# EAGLE design CompletePCBV5 (EAGLE 9.2.1)
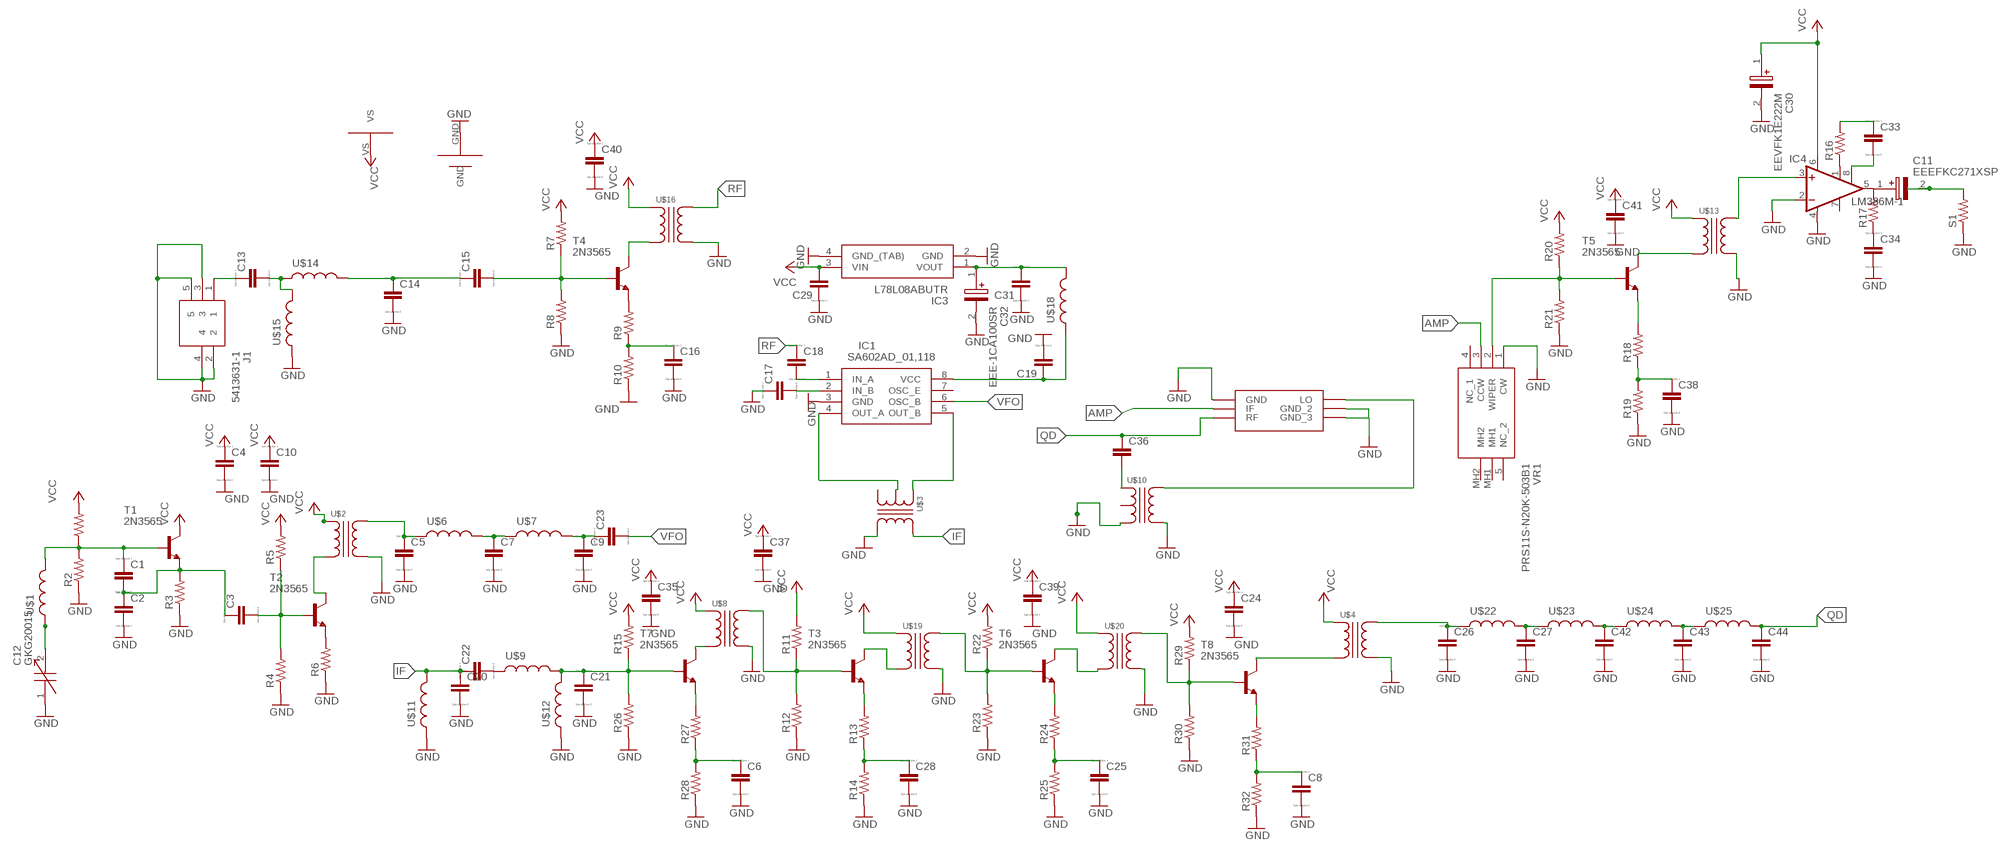
[diagram p0: schematic, sheet 1]

## Parts
C1  C  [C0805]
C2  C  [C0805]
C3  C  [C0805]
C4  C  [C0805]
C5  C  [C0805]
C6  C  [C0805]
C7  C  [C0805]
C8  C  [C0805]
C9  C  [C0805]
C10  C  [C0805]
C11  EEEFKC271XSP  [FKSV(D8)]
C12  GKG20015  [GKG20015]
C13  C  [C0805]
C14  C  [C0805]
C15  C  [C0805]
C16  C  [C0805]
C17  C  [C0805]
C18  C  [C0805]
C19  C  [C0805]
C20  C  [C0805]
C21  C  [C0805]
C22  C  [C0805]
C23  C  [C0805]
C24  C  [C0805]
C25  C  [C0805]
C26  C  [C0805]
C27  C  [C0805]
C28  C  [C0805]
C29  C  [C0805]
C30  EEVFK1E222M  [FKV(J16)]
C31  C  [C0805]
C32  EEE-1CA100SR  [SV(B)]
C33  C  [C0805]
C34  CC1206  [C1206]
C35  C  [C0805]
C36  C-EUC0805  [C0805]
C37  C  [C0805]
C38  C  [C0805]
C39  C  [C0805]
C40  C  [C0805]
C41  C  [C0805]
C42  C  [C0805]
C43  C  [C0805]
C44  C  [C0805]
IC1  SA602AD_01,118  [SOIC127P600X175-8N]
IC3  L78L08ABUTR  [ST-SOT-89]
IC4  LM386M-1  [SO08]
J1  5413631-1  [54136311]
R1  R-US_R0805  [R0805]
R2  R-US_R0805  [R0805]
R3  R-US_R0805  [R0805]
R4  R-US_R0805  [R0805]
R5  R-US_R0805  [R0805]
R6  R-US_R0805  [R0805]
R7  R-US_R0805  [R0805]
R8  R-US_R0805  [R0805]
R9  R-US_R0805  [R0805]
R10  R-US_R0805  [R0805]
R11  R-US_R0805  [R0805]
R12  R-US_R0805  [R0805]
R13  R-US_R0805  [R0805]
R14  R-US_R0805  [R0805]
R15  R-US_R0805  [R0805]
R16  R-US_R0805  [R0805]
R17  R-US_R0805  [R0805]
R18  R-US_R0805  [R0805]
R19  R-US_R0805  [R0805]
R20  R-US_R0805  [R0805]
R21  R-US_R0805  [R0805]
R22  R-US_R0805  [R0805]
R23  R-US_R0805  [R0805]
R24  R-US_R0805  [R0805]
R25  R-US_R0805  [R0805]
R26  R-US_R0805  [R0805]
R27  R-US_R0805  [R0805]
R28  R-US_R0805  [R0805]
R29  R-US_R0805  [R0805]
R30  R-US_R0805  [R0805]
R31  R-US_R0805  [R0805]
R32  R-US_R0805  [R0805]
S1  R-US_0207/5V  [0207/5V]
T1  2N3565  [TO92]
T2  2N3565  [TO92]
T3  2N3565  [TO92]
T4  2N3565  [TO92]
T5  2N3565  [TO92]
T6  2N3565  [TO92]
T7  2N3565  [TO92]
T8  2N3565  [TO92]
U$1  WOUNDINDUCTOR  [WOUNDINDUCTOR]
U$2  RFTRANSFORMER  [RFTRABSFORMER]
U$3  42IF123  [42IF123]
U$4  RFTRANSFORMER  [RFTRABSFORMER]
U$5  ALLIGATORCLIPS  [ALLIGATORCONNECTOR]
U$6  WOUNDINDUCTOR  [WOUNDINDUCTOR]
U$7  WOUNDINDUCTOR  [WOUNDINDUCTOR]
U$8  RFTRANSFORMER  [RFTRABSFORMER]
U$9  WOUNDINDUCTOR  [WOUNDINDUCTOR]
U$10  42IF123  [42IF123]
U$11  WOUNDINDUCTOR  [WOUNDINDUCTOR]
U$12  WOUNDINDUCTOR  [WOUNDINDUCTOR]
U$13  RFTRANSFORMER  [RFTRABSFORMER]
U$14  WOUNDINDUCTOR  [WOUNDINDUCTOR]
U$15  WOUNDINDUCTOR  [WOUNDINDUCTOR]
U$16  RFTRANSFORMER  [RFTRABSFORMER]
U$17  ADE-1  [ADE-1]
U$18  WOUNDINDUCTOR  [WOUNDINDUCTOR]
U$19  RFTRANSFORMER  [RFTRABSFORMER]
U$20  RFTRANSFORMER  [RFTRABSFORMER]
U$22  WOUNDINDUCTOR  [WOUNDINDUCTOR]
U$23  WOUNDINDUCTOR  [WOUNDINDUCTOR]
U$24  WOUNDINDUCTOR  [WOUNDINDUCTOR]
U$25  WOUNDINDUCTOR  [WOUNDINDUCTOR]
VR1  PRS11S-N20K-503B1  [PRS11SN20K503B1]

## Nets
AMP: U$17.IF VR1.3(CCW)
GND: C2.2 C4.2 C5.2 C6.2 C7.2 C8.2 C9.2 C10.2 C12.1 C14.2 C16.2 C17.1 C19.2 C20.2 C21.2 C24.2 C25.2 C26.2 C27.2 C28.2 C29.1 C30.2(-) C31.1 C32.2(-) C34.2 C35.2 C37.2 C38.2 C39.2 C40.2 C41.2 C42.2 C43.2 C44.2 IC1.3(GND) IC3.2(GND) IC3.4(GND_(TAB)) IC4.2(-IN) IC4.4(GND) J1.2 J1.3 J1.4 J1.5 R2.1 R3.1 R4.1 R6.1 R8.1 R10.1 R12.1 R14.1 R19.1 R21.1 R23.1 R25.1 R26.1 R28.1 R30.1 R32.1 S1.1 U$2.P$4 U$3.P$4 U$4.P$4 U$5.GND U$8.P$4 U$10.P$3 U$10.P$4 U$11.1 U$12.1 U$13.P$4 U$15.1 U$16.P$4 U$17.GND U$17.GND2(GND_2) U$17.GND3(GND_3) U$19.P$4 U$20.P$4 VR1.1(CW)
IF: C20.1 C22.1 U$3.P$5 U$11.2
N$1: R6.2 T2.3(E)
N$2: T7.1(C) U$8.P$1
N$3: C1.2 C2.1 C3.1 R3.2 T1.3(E)
N$4: C1.1 R1.1 R2.2 T1.2(B) U$1.2
N$5: C3.2 R4.2 R5.1 T2.2(B)
N$6: R22.1 R23.2 T6.2(B) U$19.P$3
N$7: C22.2 U$9.1
N$8: C5.1 U$2.P$3 U$6.1
N$9: R9.2 T4.3(E)
N$10: C7.1 U$6.2 U$7.1
N$11: T2.1(C) U$2.P$1
N$12: C12.2 U$1.1
N$13: C9.1 C23.1 U$7.2
N$14: C16.1 R9.1 R10.2
N$15: C13.1 J1.1
N$16: C14.1 C15.1 U$14.2
N$18: C15.2 R7.1 R8.2 T4.2(B)
N$19: T4.1(C) U$16.P$1
N$20: IC1.5(OUT_B) U$3.P$2
N$21: IC1.4(OUT_A) U$3.P$1
N$22: C28.1 R13.1 R14.2
N$23: C17.2 IC1.2(IN_B)
N$24: C18.2 IC1.1(IN_A)
N$25: C36.2 U$10.P$2
N$26: R29.1 R30.2 T8.2(B) U$20.P$3
N$27: U$10.P$5 U$17.LO
N$28: R20.1 R21.2 T5.2(B) VR1.2(WIPER)
N$29: R18.2 T5.3(E)
N$30: C38.1 R18.1 R19.2
N$31: R11.1 R12.2 T3.2(B) U$8.P$3
N$32: T5.1(C) U$13.P$1
N$33: T3.1(C) U$19.P$1
N$34: C19.1 IC1.8(VCC) U$18.1
N$35: IC4.3(+IN) U$13.P$3
N$36: C13.2 U$14.1 U$15.2
N$37: R24.2 T6.3(E)
N$38: C25.1 R24.1 R25.2
N$39: R13.2 T3.3(E)
N$40: IC4.1(GAIN) R16.1
N$41: C11.1(+) IC4.5(OUT) R17.2
N$42: C34.1 R17.1
N$43: C21.1 R15.1 R26.2 T7.2(B) U$9.2 U$12.2
N$44: C33.1 R16.2
N$45: C33.2 IC4.8(GAIN)
N$46: C11.2(-) S1.2
N$47: C31.2 C32.1(+) IC3.1(VOUT) U$18.2
N$48: R31.2 T8.3(E)
N$49: C6.1 R27.1 R28.2
N$50: R27.2 T7.3(E)
N$51: C8.1 R31.1 R32.2
N$52: T6.1(C) U$20.P$1
N$53: C26.1 U$4.P$3 U$22.1
N$54: T8.1(C) U$4.P$1
N$55: C27.1 U$22.2 U$23.1
N$56: C42.1 U$23.2 U$24.1
N$57: C43.1 U$24.2 U$25.1
QD: C36.1 C44.1 U$17.RF U$25.2
RF: C18.1 U$16.P$3
VCC: C4.1 C10.1 C24.1 C29.2 C30.1(+) C35.1 C37.1 C39.1 C40.1 C41.1 IC3.3(VIN) IC4.6(VS) R1.2 R5.2 R7.2 R11.2 R15.2 R20.2 R22.2 R29.2 T1.1(C) U$2.P$2 U$4.P$2 U$5.VS U$8.P$2 U$13.P$2 U$16.P$2 U$19.P$2 U$20.P$2
VFO: C23.2 IC1.6(OSC_B)
Unconnected: IC1.7(OSC_E) IC4.7(BYPASS) U$3.P$3 U$10.P$1 VR1.4(NC_1) VR1.5(NC_2) VR1.MH1 VR1.MH2

## Library data of the parts
C1-C10 C13-C29 C31 C33-C35 C37-C44 = eagle-ltspice:C: CAPACITOR, European symbol; SPICEMODEL: NONE; SPICEPREFIX: C
C11 = SamacSys_Parts:EEEFKC271XSP: Panasonic 270uF 16 V dc Aluminium Electrolytic Capacitor, FKS Series 2000h 6.3 (Dia.) x 7.7mm Source: Datasheet <https://industrial.panasonic.com/cdbs/www-data/pdf/RDE0000/ABA0000C569.pdf>; DESCRIPTION: Panasonic 270uF 16 V dc Aluminium Electrolytic Capacitor, FKS Series 2000h 6.3 (Dia.) x 7.7mm; HEIGHT: mm; MANUFACTURER_NAME: Panasonic; MANUFACTURER_PART_NUMBER: EEEFKC271XSP
C12 = SamacSys_Parts:GKG20015: Trimmer / Variable Capacitors 5-20pF 100V 85 DEG Source: Datasheet <http://www.mouser.com/datasheet/2/384/659305J-1204018.pdf>; DESCRIPTION: Trimmer / Variable Capacitors 5-20pF 100V 85 DEG; HEIGHT: 5.1mm; MANUFACTURER_NAME: Sprague Goodman; MANUFACTURER_PART_NUMBER: GKG20015; MOUSER_PART_NUMBER: 659-GKG20015; MOUSER_PRICE-STOCK: https://www.mouser.com/Search/Refine.aspx?Keyword=659-GKG20015
C30 = SamacSys_Parts:EEVFK1E222M: Ecap 2200uF 25V J16 Case FK SMD Panasonic Aluminium Electrolytic Capacitor 2200uF 25 V dc 16mm Surface Mount series FK SMD lifetime 5000h Source: Datasheet <https://industrial.panasonic.com/cdbs/www-data/pdf/RDE0000/ABA0000C1181.pdf>; DESCRIPTION: Ecap 2200uF 25V J16 Case FK SMD Panasonic Aluminium Electrolytic Capacitor 2200uF 25 V dc 16mm Surface Mount series FK SMD lifetime 5000h; HEIGHT: mm; MANUFACTURER_NAME: Panasonic; MANUFACTURER_PART_NUMBER: EEVFK1E222M
C32 = SamacSys_Parts:EEE-1CA100SR: Aluminum Electrolytic Capacitors - SMD 10uF 16V Source: Datasheet <https://componentsearchengine.com/Datasheets/1/EEE-1CA100SR.pdf>; DESCRIPTION: Aluminum Electrolytic Capacitors - SMD 10uF 16V; HEIGHT: mm; MANUFACTURER_NAME: Panasonic; MANUFACTURER_PART_NUMBER: EEE-1CA100SR; MOUSER_PART_NUMBER: 667-EEE-1CA100SR; MOUSER_PRICE-STOCK: https://www.mouser.com/Search/Refine.aspx?Keyword=667-EEE-1CA100SR
C36 = rcl:C-EU: CAPACITOR, European symbol; SPICEPREFIX: C
IC1 = SamacSys_Parts:SA602AD_01,118: NXP - SA602AD/01,118 - DOUBLE-BALANCED MIXER, 500MHZ, SOIC-8 Source: Datasheet <https://www.mouser.com/datasheet/2/302/SA602A-1127653.pdf>; DESCRIPTION: NXP - SA602AD/01,118 - DOUBLE-BALANCED MIXER, 500MHZ, SOIC-8; HEIGHT: 1.75mm; MANUFACTURER_NAME: NXP; MANUFACTURER_PART_NUMBER: SA602AD/01,118; MOUSER_PART_NUMBER: 771-SA602AD/01-T
IC3 = SamacSys_Parts:L78L08ABUTR: L78L08ABUTR, Voltage Regulator, 0.1A 8 V, 4-Pin SOT-89 Source: Datasheet <https://componentsearchengine.com/Datasheets/1/L78L08ABUTR.pdf>; DESCRIPTION: L78L08ABUTR, Voltage Regulator, 0.1A 8 V, 4-Pin SOT-89; HEIGHT: mm; MANUFACTURER_NAME: STMicroelectronics; MANUFACTURER_PART_NUMBER: L78L08ABUTR; MOUSER_PART_NUMBER: 511-L78L08ABU; MOUSER_PRICE-STOCK: https://www.mouser.com/Search/Refine.aspx?Keyword=511-L78L08ABU
IC4 = linear:LM386?-*: Low Voltage Audio Power Amplifier Source: http://cache.national.com/ds/LM/LM386.pdf
J1 = SamacSys_Parts:5413631-1: TE Connectivity Right Angle 50 Through Hole BNC Connector, jack, Nickel, Solder Termination Source: Datasheet <https://componentsearchengine.com/Datasheets/1/5413631-1.pdf>; DESCRIPTION: TE Connectivity Right Angle 50 Through Hole BNC Connector, jack, Nickel, Solder Termination; HEIGHT: 11.15mm; MANUFACTURER_NAME: TE Connectivity; MANUFACTURER_PART_NUMBER: 5413631-1; MOUSER_PART_NUMBER: 571-5413631-1; MOUSER_PRICE-STOCK: https://www.mouser.com/Search/Refine.aspx?Keyword=571-5413631-1
R1-R32 = resistor:R-US_: RESISTOR, American symbol
S1 = rcl:R-US_: RESISTOR, American symbol; SPICEPREFIX: R
T1-T8 = transistor:2N3565: NPN TRANSISTOR
U$1 U$6 U$7 U$9 U$11 U$12 U$14 U$15 U$18 U$22-U$25 = Custom:WOUNDINDUCTOR
U$2 U$4 U$8 U$13 U$16 U$19 U$20 = Custom:RFTRANSFORMER
U$3 U$10 = Custom:42IF123
U$5 = Custom:ALLIGATORCLIPS
U$17 = Custom:ADE-1
VR1 = SamacSys_Parts:PRS11S-N20K-503B1: Res Carbon Film POT 50K Ohm 20% 0.05W(1/20W) 1(Elec)/1(Mech)Turn 6mm (11.7 X 18.5 X 21.4mm) Gull Wing SMD Tube Source: Datasheet <https://componentsearchengine.com/Datasheets/1/PRS11S-N20K-503B1.pdf>; DESCRIPTION: Res Carbon Film POT 50K Ohm 20% 0.05W(1/20W) 1(Elec)/1(Mech)Turn 6mm (11.7 X 18.5 X 21.4mm) Gull Wing SMD Tube; HEIGHT: 20mm; MANUFACTURER_NAME: Bourns; MANUFACTURER_PART_NUMBER: PRS11S-N20K-503B1; MOUSER_PART_NUMBER: 652-PRS11SN20K503B1; MOUSER_PRICE-STOCK: https://www.mouser.com/Search/Refine.aspx?Keyword=652-PRS11SN20K503B1

## Net classes
0 default: width 0.762 mm
1 POWER: width 0.381 mm
2 RF: width 0.635 mm
3 VCC: width 0.889 mm

## Board
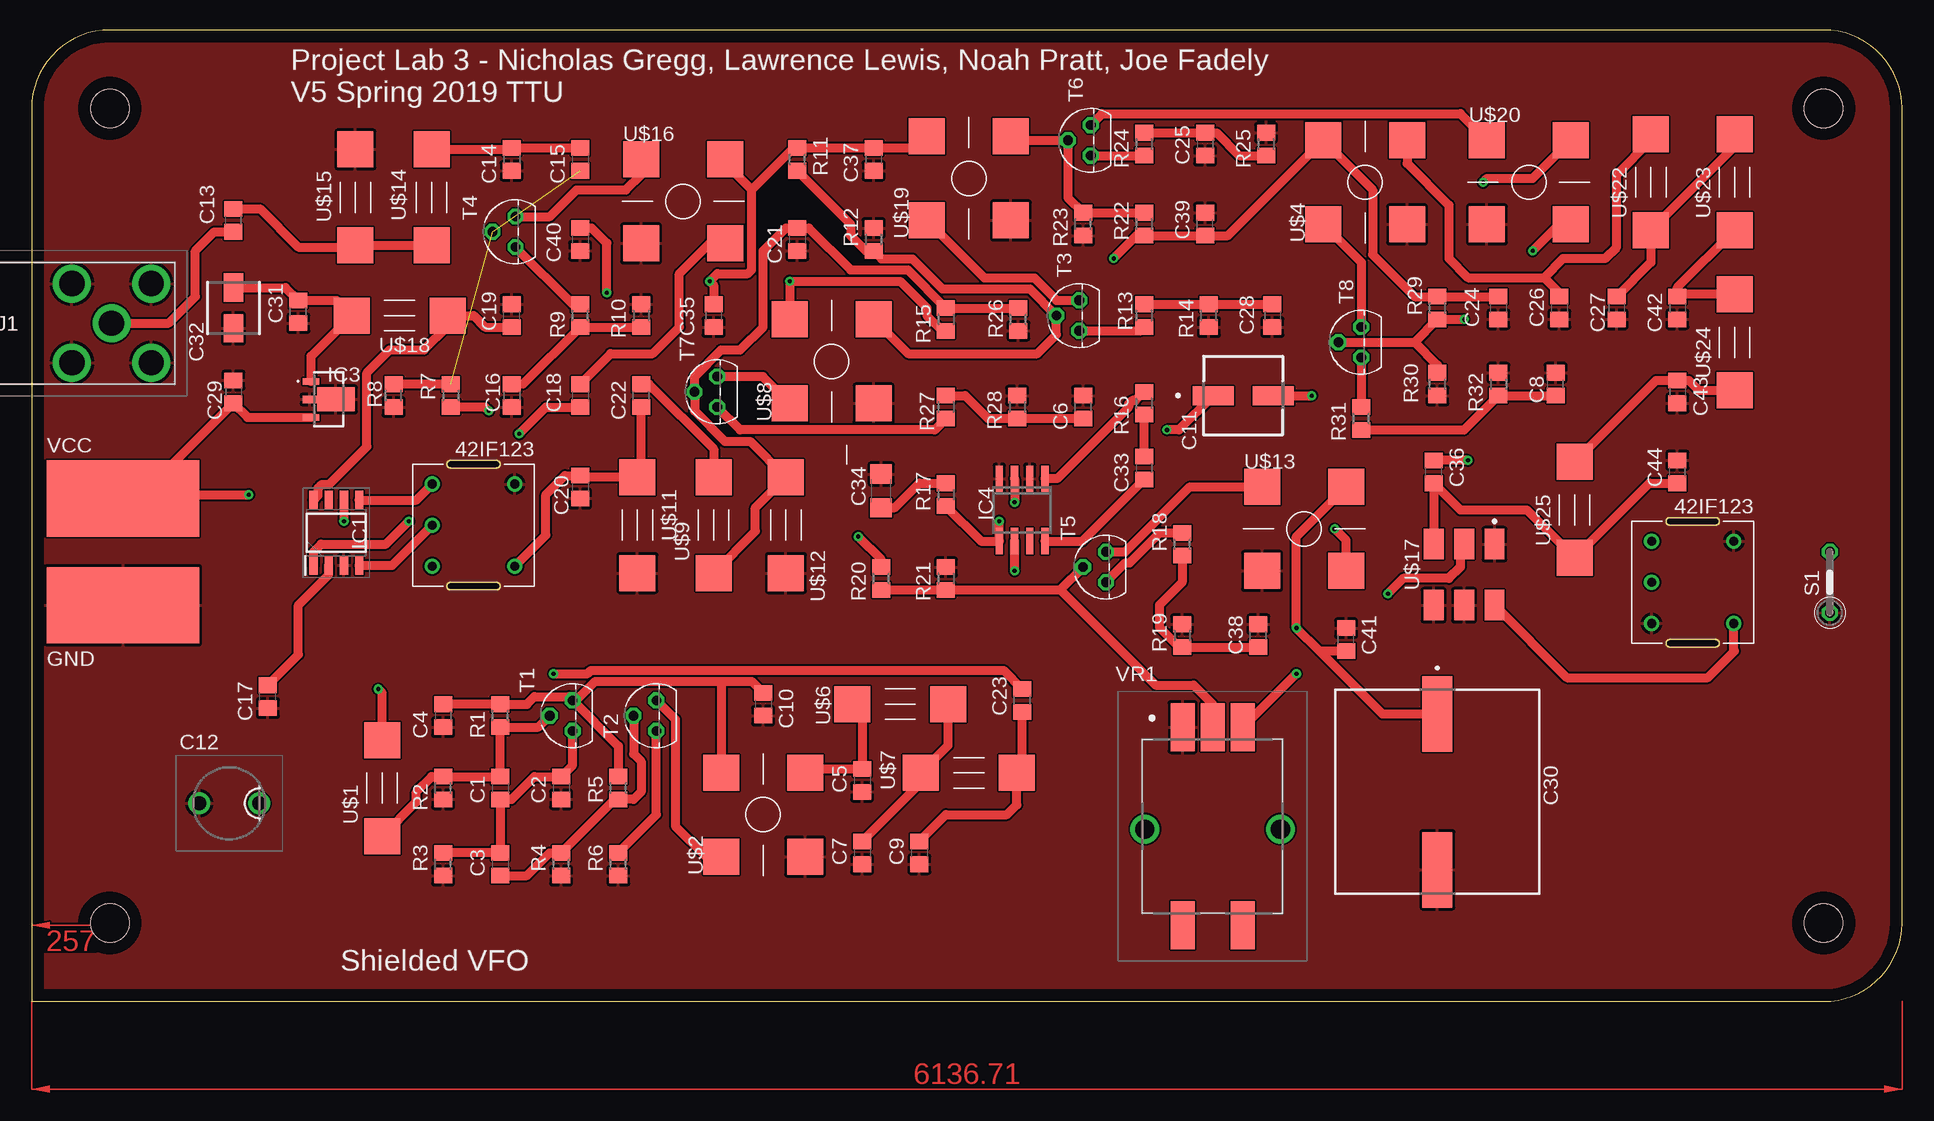
[diagram p1: board, top side]
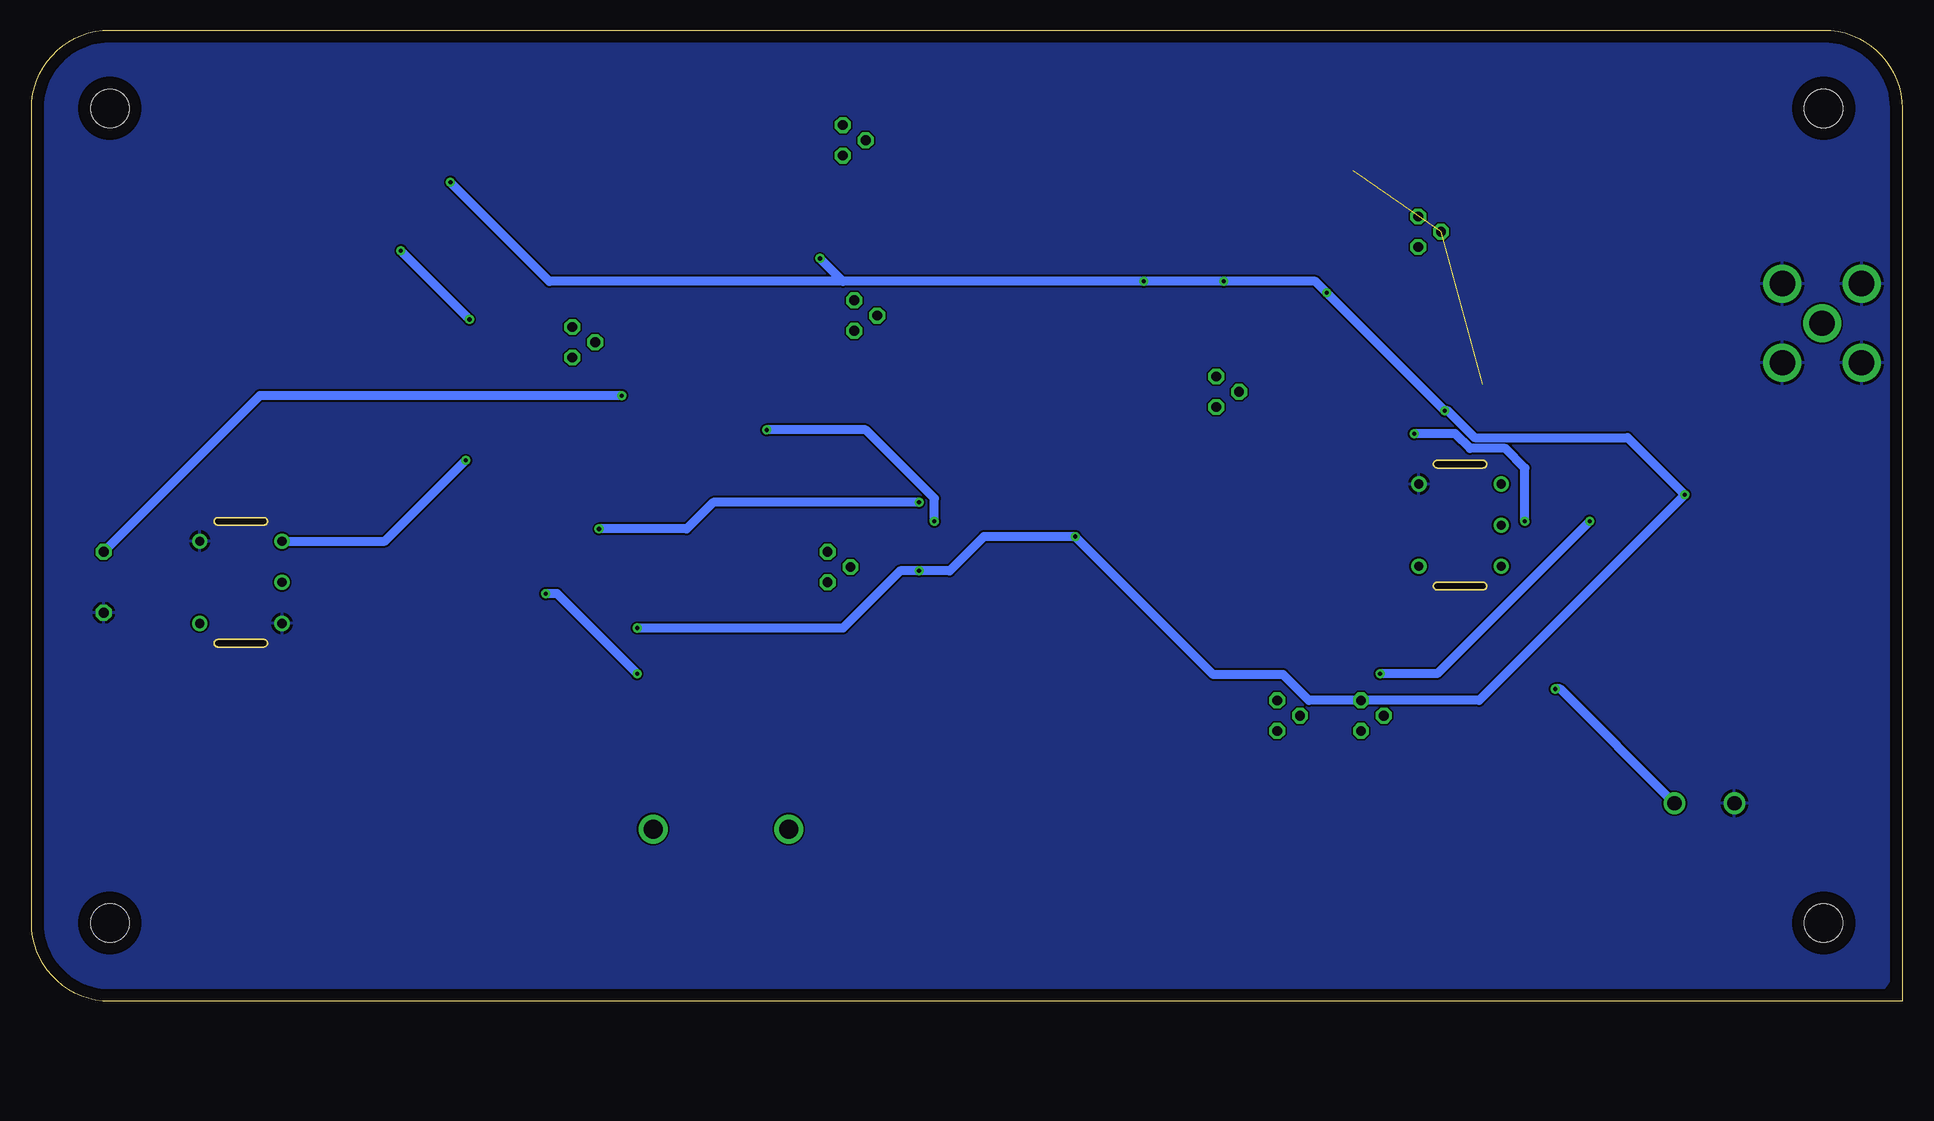
[diagram p2: board, bottom side, seen from below]

Size 155.87 x 80.95 mm. Coordinates in mm from the lower left corner, seen from the top.
Outline: 0,74.42 0,0 149.34,0 arc90 155.87,6.53 155.87,74.42 arc90 149.34,80.95 6.53,80.95 arc90 0,74.42
Copper layers (1*16): Top 0.035mm / dielectric 1.5mm / Bottom 0.035mm
Design rules "default": minimum track width 6mil, minimum drill 0.35mm, track to track 6mil, track to pad 6mil, pad to pad 6mil, via to via 6mil, smd to smd 6mil, copper to edge 40mil, drill to drill 6mil, minimum pad ring 10mil, minimum via ring 8mil, stop-mask expansion 4mil, vias tented up to drill 0mil, thermal gap 10mil
Holes 3.2 mm at 6.53,74.42 149.34,74.42 149.34,6.53 6.53,6.53

### Footprints (pad centres in the part's own frame; a part is rotated, then mirrored left to right if it is on the bottom)
C0805 = smd 1.3 x 1.5: 1 -0.95,0; 2 0.95,0
FKSV(D8) = smd 3.4 x 1.6: 1 -2.5,0; 2 2.5,0
GKG20015 = drill 1.2 pad 1.8: 1 0,0; 2 5,0
FKV(J16) = smd 6.3 x 2.5: 1 -6.5,0; 2 6.5,0
SV(B) = smd 2.35 x 1.6: 1 -1.7,0; 2 1.7,0
C1206 = smd 1.6 x 1.8: 1 -1.4,0; 2 1.4,0
SOIC127P600X175-8N = smd 1.55 x 0.7: 1 -2.725,1.905; 2 -2.725,0.635; 3 -2.725,-0.635; 4 -2.725,-1.905; 5 2.725,-1.905; 6 2.725,-0.635; 7 2.725,0.635; 8 2.725,1.905
ST-SOT-89 = smd 0.57 x 1.4: 1 -1.5,-1.475; 3 1.5,-1.475 | smd 0.65 x 1.2: 2 0,-1.575 | smd 2 x 3.15: 4 0,0.6
SO08 = smd 0.6 x 2.2: 1 -1.905,-2.6; 2 -0.635,-2.6; 3 0.635,-2.6; 4 1.905,-2.6; 5 1.905,2.6; 6 0.635,2.6; 7 -0.635,2.6; 8 -1.905,2.6
54136311 = drill 2.11 pad 3.165: 1 0,0; 2 -3.3,3.3; 3 -3.3,-3.3; 4 3.3,-3.3; 5 3.3,3.3
R0805 = smd 1.3 x 1.5: 1 -0.95,0; 2 0.95,0
0207/5V = drill 0.813 octagon: 1 -2.54,0; 2 2.54,0
TO92 = drill 0.813 octagon: 1 1.27,0; 2 0,1.905; 3 -1.27,0
WOUNDINDUCTOR = smd 3 x 3: 1 0,4; 2 0,-4
RFTRABSFORMER = smd 3 x 3: P$1 -3.5,3.5; P$2 3.5,3.5; P$3 3.5,-3.5; P$4 -3.5,-3.5
42IF123 = drill 0.762: P$1 -3.429,0; P$2 -3.429,3.429; P$3 -3.429,-3.429; P$4 3.429,3.429; P$5 3.429,-3.429
ALLIGATORCONNECTOR = smd 6.35 x 12.7: GND 7.62,2.54; VS -1.27,2.54
ADE-1 = smd 1.65 x 2.54: GND -2.54,-2.54; GND2 0,2.54; GND3 2.54,2.54; IF 0,-2.54; LO -2.54,2.54; RF 2.54,-2.54
PRS11SN20K503B1 = smd 2 x 4: 1 2.5,-8.25; 2 0,-8.25; 3 -2.5,-8.25; 4 -2.5,8.25; 5 2.5,8.25 | drill 1.6 pad 2.4: MH1 -5.65,0.25; MH2 5.65,0.25

### Placement (x,y rotation side)
C1  39.05,17.78 270 top
C2  44.13,17.78 270 top
C3  39.05,11.43 270 top
C4  34.29,23.81 270 top
C5  69.22,18.41 270 top
C6  87.63,49.53 90 top
C7  69.22,12.38 270 top
C8  127,51.44 90 top
C9  73.98,12.38 270 top
C10  60.96,24.77 270 top
C11  100.97,50.48 0 top
C12  13.97,16.51 0 top
C13  16.83,65.09 90 top
C14  40.01,70.17 270 top
C15  45.72,70.17 270 top
C16  40.01,50.48 270 top
C17  19.68,25.4 90 top
C18  45.72,50.48 270 top
C19  40.01,57.15 90 top
C20  45.72,42.86 270 top
C21  63.82,63.5 270 top
C22  50.8,50.48 90 top
C23  82.55,25.08 90 top
C24  122.24,57.78 270 top
C25  97.79,71.44 270 top
C26  127.32,57.78 270 top
C27  132.08,57.78 270 top
C28  103.41,57.15 270 top
C29  16.83,50.8 270 top
C30  117.16,17.46 270 top
C31  22.23,57.47 90 top
C32  16.83,57.78 270 top
C33  92.71,44.45 270 top
C34  70.8,42.55 90 top
C35  56.83,57.15 270 top
C36  116.84,44.13 90 top
C37  70.17,70.17 270 top
C38  102.23,30.48 90 top
C39  97.79,64.77 90 top
C40  45.72,63.5 270 top
C41  109.54,30.16 90 top
C42  137.16,57.78 270 top
C43  137.16,50.8 270 top
C44  137.16,44.13 90 top
IC1  25.4,39.05 90 top
IC3  24.77,50.16 270 top
IC4  82.55,40.96 180 top
J1  6.67,56.52 0 top
R1  39.05,23.81 90 top
R2  34.29,17.78 90 top
R3  34.29,11.43 90 top
R4  44.13,11.43 90 top
R5  48.9,17.78 90 top
R6  48.9,11.43 90 top
R7  34.92,50.48 270 top
R8  30.16,50.48 90 top
R9  45.72,57.15 90 top
R10  50.8,57.15 270 top
R11  63.82,70.17 90 top
R12  70.17,63.5 270 top
R13  92.71,57.15 270 top
R14  98.11,57.15 90 top
R15  76.2,56.83 270 top
R16  92.71,49.85 270 top
R17  76.2,42.23 270 top
R18  95.89,38.1 90 top
R19  95.89,30.48 270 top
R20  70.8,35.24 90 top
R21  76.2,35.24 270 top
R22  92.71,64.77 270 top
R23  87.63,64.77 90 top
R24  92.71,71.44 270 top
R25  102.87,71.44 270 top
R26  82.23,56.83 90 top
R27  76.2,49.53 270 top
R28  82.14,49.53 270 top
R29  117.16,57.78 90 top
R30  117.16,51.44 90 top
R31  110.81,48.58 90 top
R32  122.24,51.44 270 top
S1  149.86,34.92 90 top
T1  45.09,23.81 90 top
T2  52.07,23.81 90 top
T3  87.31,57.15 90 top
T4  40.32,64.14 90 top
T5  89.53,36.2 90 top
T6  88.27,71.75 90 top
T7  57.15,50.8 90 top
T8  110.81,54.93 90 top
U$1  29.21,17.78 0 top
U$2  60.96,15.56 90 top
U$3  36.83,39.69 0 top
U$4  111.12,68.26 90 top
U$5  5.08,40.64 270 top
U$6  72.39,24.77 90 top
U$7  78.11,19.05 90 top
U$8  66.67,53.34 90 top
U$9  56.83,39.69 0 top
U$10  138.43,34.92 0 top
U$11  50.48,39.69 180 top
U$12  62.87,39.69 180 top
U$13  106.05,39.37 0 top
U$14  33.34,66.99 180 top
U$15  26.99,66.99 0 top
U$16  54.29,66.67 0 top
U$17  119.38,35.56 180 top
U$18  30.67,57.15 270 top
U$19  78.11,68.58 90 top
U$20  124.78,68.26 0 top
U$22  134.94,68.26 0 top
U$23  141.92,68.26 0 top
U$24  141.92,54.93 0 top
U$25  128.59,40.96 0 top
VR1  98.42,14.61 180 top

### Tracks (layer width: path | path; a pad name or v marks a point on that pad's centre or on a via)
AMP  (via drill 0.35)
  Top 0.762: VR1.3 105.38,27.3 v105.41,27.3 | U$17.IF 119.06,37.78 119.06,36.2 118.11,35.24 114.3,35.24 v113.03,33.97
  Bottom 0.762: v105.41,27.3 112.08,33.97 v113.03,33.97
GND
  pour Top: 0,80.01 158.12,80.01 158.12,-1.27 0,-1.27
  pour Bottom: 0,80.01 158.43,80.01 158.43,-1.27 6.53,-1.27 arc-90 0,5.26
HOLE
  cutout Top: 136.53,40.32 140.34,40.32 arc-90 140.65,40.01 arc-90 140.34,39.69 136.53,39.69 arc-180
HOLE1
  cutout Top: 136.53,30.16 140.34,30.16 arc-90 140.65,29.84 arc-90 140.34,29.53 136.53,29.53 arc-180
HOLE2
  cutout Top: 34.92,45.09 38.73,45.09 arc-90 39.05,44.77 arc-90 38.73,44.45 34.92,44.45 arc-180
HOLE3
  cutout Top: 34.92,34.92 38.73,34.92 arc-90 39.05,34.61 arc-90 38.73,34.29 34.92,34.29 arc-180
IF
  Top 0.762: U$3.P$5 42.86,38.86 42.86,42.23 44.45,43.81 C20.1 45.84,43.69 U$11.2 50.8,44.01 C22.1
N$1
  Top 0.762: R6.2 52.07,15.55 T2.3
N$2
  Top 0.762: U$8.P$1 60.95,52.07 T7.1
N$3
  Top 0.762: T1.3 45.09,19.68 C2.1 41.91,18.73 40.01,16.83 C1.2 C3.1 R3.2
N$4
  Top 0.762: U$1.2 32.07,16.64 32.07,17.46 33.34,18.73 R2.2 C1.1 R1.1 42.23,22.86 T1.2
N$5
  Top 0.762: C3.2 41.28,10.48 43.18,12.38 R4.2 48.58,16.83 R5.1 50.16,16.83 50.8,17.46 50.8,20 50.16,20.64 T2.2
N$6
  Top 0.762: U$19.P$3 81.93,71.75 T6.2 86.36,66.99 R23.2 R22.1
N$7
  Top 0.762: C22.2 51.44,51.43 56.83,46.04 U$9.1
N$8
  Top 0.762: U$6.1 69.22,23.94 C5.1 64.77,19.36 U$2.P$3
N$9
  Top 0.762: T4.3 45.09,58.1 R9.2
N$10
  Top 0.762: C7.1 74.11,18.22 U$7.1 76.39,21.34 U$6.2
N$11
  Top 0.762: T2.1 53.66,23.5 53.66,14.61 56.2,12.06 U$2.P$1
N$12  (via drill 0.35)
  Top 0.762: U$1.1 29.21,25.72 v28.89,26.04
  Bottom 0.762: C12.2 28.5,26.04 v28.89,26.04
N$13
  Top 0.762: C9.1 76.2,15.56 81.28,15.56 82.11,16.38 U$7.2 82.55,19.5 C23.1
N$14
  Top 0.762: C16.1 40.95,51.43 R9.1 R10.2
N$15
  Top 0.762: J1.1 11.43,56.52 13.65,58.74 13.65,62.55 15.24,64.14 C13.1
N$16
  Top 0.762: U$14.2 39.88,70.99 C14.1 C15.1
N$18  (2 unrouted)
  Top 0.762: R7.1 R8.2
N$19
  Top 0.762: T4.1 43.2,65.41 45.42,67.63 49.53,67.63 50.79,68.89 U$16.P$1
N$20
  Top 0.762: IC1.5 32.06,41.78 U$3.P$2
N$21
  Top 0.762: IC1.4 30.04,36.33 U$3.P$1
N$22
  Top 0.762: R13.1 R14.2 C28.1
N$23
  Top 0.762: C17.2 22.23,28.89 22.23,33.02 24.77,35.56 IC1.2
N$24  (via drill 0.35)
  Top 0.762: IC1.1 23.5,37.47 24.13,38.1 29.53,38.1 v31.43,40.01 | v40.64,47.31 42.87,49.53 C18.2
  Bottom 0.762: v31.43,40.01 31.43,44.45 33.06,46.08 36,46.08 37.23,47.31 v40.64,47.31
N$25  (via drill 0.35)
  Top 0.762: v119.7,45.09 C36.2
  Bottom 0.762: U$10.P$2 126.43,38.35 v119.7,45.09
N$26  (via drill 0.35)
  Top 0.762: T8.2 115.25,54.93 | 115.25,54.93 R29.1 v119.38,56.83 | 115.25,54.93 117.16,53.02 R30.2 | v125.09,62.55 127.31,64.76 U$20.P$3
  Bottom 0.762: v119.38,56.83 v125.09,62.55
N$27
  Top 0.762: U$10.P$5 141.86,29.27 141.92,29.21 139.7,26.99 127.95,26.99 U$17.LO
N$28
  Top 0.762: R20.1 R21.2 85.73,34.29 | 85.73,34.29 T5.2 | 85.73,34.29 93.67,26.35 96.84,26.35 98.42,24.77 VR1.2
N$29
  Top 0.762: T5.3 91.16,36.55 91.5,36.55 94,39.05 R18.2
N$30
  Top 0.762: R18.1 95.89,34.92 93.98,33.02 93.98,31.18 95.63,29.53 R19.2 C38.1
N$31
  Top 0.762: R11.1 68.26,64.77 68.26,63.82 69.53,62.55 R12.2 70.84,61.87 73.4,61.87 75.9,59.37 83.19,59.37 T3.2 85.41,55.56 83.82,53.98 73.04,53.98 U$8.P$3
N$32
  Top 0.762: T5.1 91.12,37.47 96.53,42.87 U$13.P$1
N$33
  Top 0.762: U$19.P$1 79.4,60.29 83.56,60.29 85.43,58.42 T3.1
N$34
  Top 0.762: IC1.8 23.88,42.16 23.88,42.77 24.19,43.09 24.8,43.09 27.94,46.22 27.94,52.39 29.84,54.29 32.7,54.29 34.67,56.26 U$18.1 36.83,57.15 37.78,56.2 C19.1
N$35  (via drill 0.35)
  Top 0.762: U$13.P$3 109.55,38.41 v108.58,39.37 | IC4.3 v81.92,41.59
  Bottom 0.762: v81.92,41.59 99.06,41.59 101.28,39.37 v108.58,39.37
N$36
  Top 0.762: C13.2 19.05,66.04 22.23,62.87 26.86,62.87 U$15.2 U$14.1
N$37
  Top 0.762: T6.3 R24.2
N$38
  Top 0.762: R24.1 C25.1 98.75,72.39 100.65,70.48 R25.2
N$39
  Top 0.762: T3.3 92.39,55.88 R13.2
N$40
  Top 0.762: IC4.1 85.47,43.56 91.43,49.51 91.43,49.77 91.74,50.08 91.99,50.08 R16.1
N$41  (via drill 0.35)
  Top 0.762: R17.2 79.12,38.36 IC4.5 v80.64,40.01 | C11.1 95.61,47.62 v94.61,47.62
  Bottom 0.762: v80.64,40.01 80.64,41.91 86.36,47.62 v94.61,47.62
N$42
  Top 0.762: C34.1 71.94,41.15 73.98,43.18 R17.1
N$43
  Top 0.762: U$9.2 60.33,39.18 60.33,41.15 U$12.2 59.88,46.67 57.78,46.67 55.24,49.21 T7.2 55.24,52.07 57.47,54.29 59.05,54.29 60.96,56.2 60.96,62.55 62.86,64.45 C21.1 64.77,64.45 68.26,60.96 73.02,60.96 R15.1 R26.2
N$44
  Top 0.762: C33.1 R16.2
N$45
  Top 0.762: IC4.8 87.57,38.36 C33.2
N$46  (via drill 0.35)
  Top 0.762: C11.2 v106.68,50.48
  Bottom 0.762: v106.68,50.48 136.84,50.48 S1.2
N$47
  Top 0.762: IC3.1 23.29,53.77 U$18.2 25.4,58.42 C31.2 21.16,59.48 C32.1
N$48
  Top 0.762: T8.3 R31.2
N$49
  Top 0.762: R27.1 77.79,50.48 79.69,48.58 R28.2 C6.1
N$50
  Top 0.762: R27.2 75.25,47.62 59.05,47.62 T7.3
N$51
  Top 0.762: R31.1 119.38,47.63 R32.2 C8.1
N$52
  Top 0.762: T6.1 89.22,73.98 119.06,73.98 U$20.P$1
N$53
  Top 0.762: U$4.P$3 114.62,69.84 118.11,66.36 118.11,61.91 119.7,60.33 126.05,60.33 | 126.05,60.33 127.32,59.05 C26.1 | 126.05,60.33 127.64,61.91 131.13,61.91 132.08,62.87 132.08,68.9 134.94,71.75 U$22.1
N$54
  Top 0.762: U$4.P$1 110.81,61.58 T8.1
N$55
  Top 0.762: U$23.1 141.92,71.25 U$22.2 134.94,61.59 C27.1
N$56
  Top 0.762: U$23.2 137.16,59.5 C42.1 137.35,58.93 U$24.1
N$57
  Top 0.762: U$25.1 135.38,51.75 C43.1 138.11,51.75 138.94,50.93 U$24.2
PORT
  cutout Bottom: 136.21,40.01 arc-90 136.53,40.32 140.34,40.32 arc-90 140.65,40.01 arc-90 140.34,39.69 136.53,39.69 arc-90
PORT1
  cutout Bottom: 136.21,29.84 arc-90 136.53,30.16 140.34,30.16 arc-90 140.65,29.84 arc-90 140.34,29.53 136.53,29.53 arc-90
PORT2
  cutout Bottom: 34.61,44.77 arc-90 34.92,45.09 38.73,45.09 arc-90 39.05,44.77 arc-90 38.73,44.45 34.92,44.45 arc-90
PORT3
  cutout Bottom: 34.61,34.61 arc-90 34.92,34.92 38.73,34.92 arc-90 39.05,34.61 arc-90 38.73,34.29 34.92,34.29 arc-90
QD
  Top 0.762: U$17.RF C36.1 119.06,40.96 124.59,40.96 U$25.2 134.81,43.18 C44.1
RF
  Top 0.762: C18.1 48.26,53.98 51.75,53.98 53.98,56.2 53.98,60.64 56.51,63.17 U$16.P$3
VCC  (via drill 0.35)
  Top 0.762: IC3.3 18.01,48.66 C29.2 8.89,41.91 U$5.VS 7.94,42.23 v18.1,42.23 | T1.1 44.77,25.4 41.91,25.4 41.27,24.76 R1.2 C4.1 | T1.1 48.9,21.27 R5.2 | T1.1 45.4,25.08 46.99,26.67 57.46,26.67 | C10.1 60.01,26.67 57.46,26.67 | 57.46,26.67 U$2.P$2 | v68.9,38.73 70.8,36.83 R20.2 | v81.92,35.88 IC4.6 | v38.1,49.21 37.78,49.53 R7.2 | v47.94,59.05 47.94,63.18 46.67,64.45 C40.1 | C35.1 56.83,59.69 v56.52,60.01 57.15,60.64 59.69,60.64 60.01,60.96 60.01,67.63 | 60.01,67.63 57.79,69.84 U$16.P$2 | 60.01,67.63 63.5,71.12 R11.2 C37.1 73.64,71.12 U$19.P$2 | U$8.P$2 63.18,56.85 v63.18,60.01 72.39,60.01 74.61,57.78 74.61,57.15 75.88,55.88 R15.2 | 107.31,29.21 v105.41,31.11 105.41,38.73 U$13.P$2 | 107.31,29.21 C41.1 | 107.31,29.21 112.56,23.96 C30.1 | C24.1 R29.2 115.25,58.73 111.76,62.23 111.76,67.63 U$4.P$2 99.68,63.82 C39.1 R22.2 92.08,63.82 v90.17,61.91 | v120.97,68.26 121.28,68.58 125.09,68.58 U$20.P$2
  Bottom 0.762: v105.41,31.11 88.27,31.11 83.5,35.88 v81.92,35.88 79.38,35.88 76.52,38.73 v68.9,38.73 57.39,27.23 51.58,27.23 49.43,25.08 T1.1 35.24,25.08 v18.1,42.23 22.86,46.99 35.62,46.99 37.84,49.21 v38.1,49.21 v47.94,59.05 48.9,60.01 v56.52,60.01 v63.18,60.01 88.27,60.01 | 88.27,60.01 v90.17,61.91 | 88.27,60.01 112.71,60.01 v120.97,68.26
VFO  (via drill 0.35)
  Top 0.762: IC1.6 v26.04,40.01 | v43.5,27.3 46.33,27.3 46.61,27.58 81,27.58 C23.2
  Bottom 0.762: v26.04,40.01 38.73,27.3 v43.5,27.3
(copper drawn outside any net)
  shapes: Top area x2

### Text on the board
tNames: Project Lab 3 - Nicholas Gregg, Lawrence Lewis, Noah Pratt, Joe Fadely / V5 Spring 2019 TTU | Shielded VFO